# Altium schematic sheet Robot_demoborad.SchDoc
size A3; Author: WANG WEN; Engineer: WANG WEN; DocumentName: Biped Robot Demoboard; ProjectName: Biped Robot Demoboard
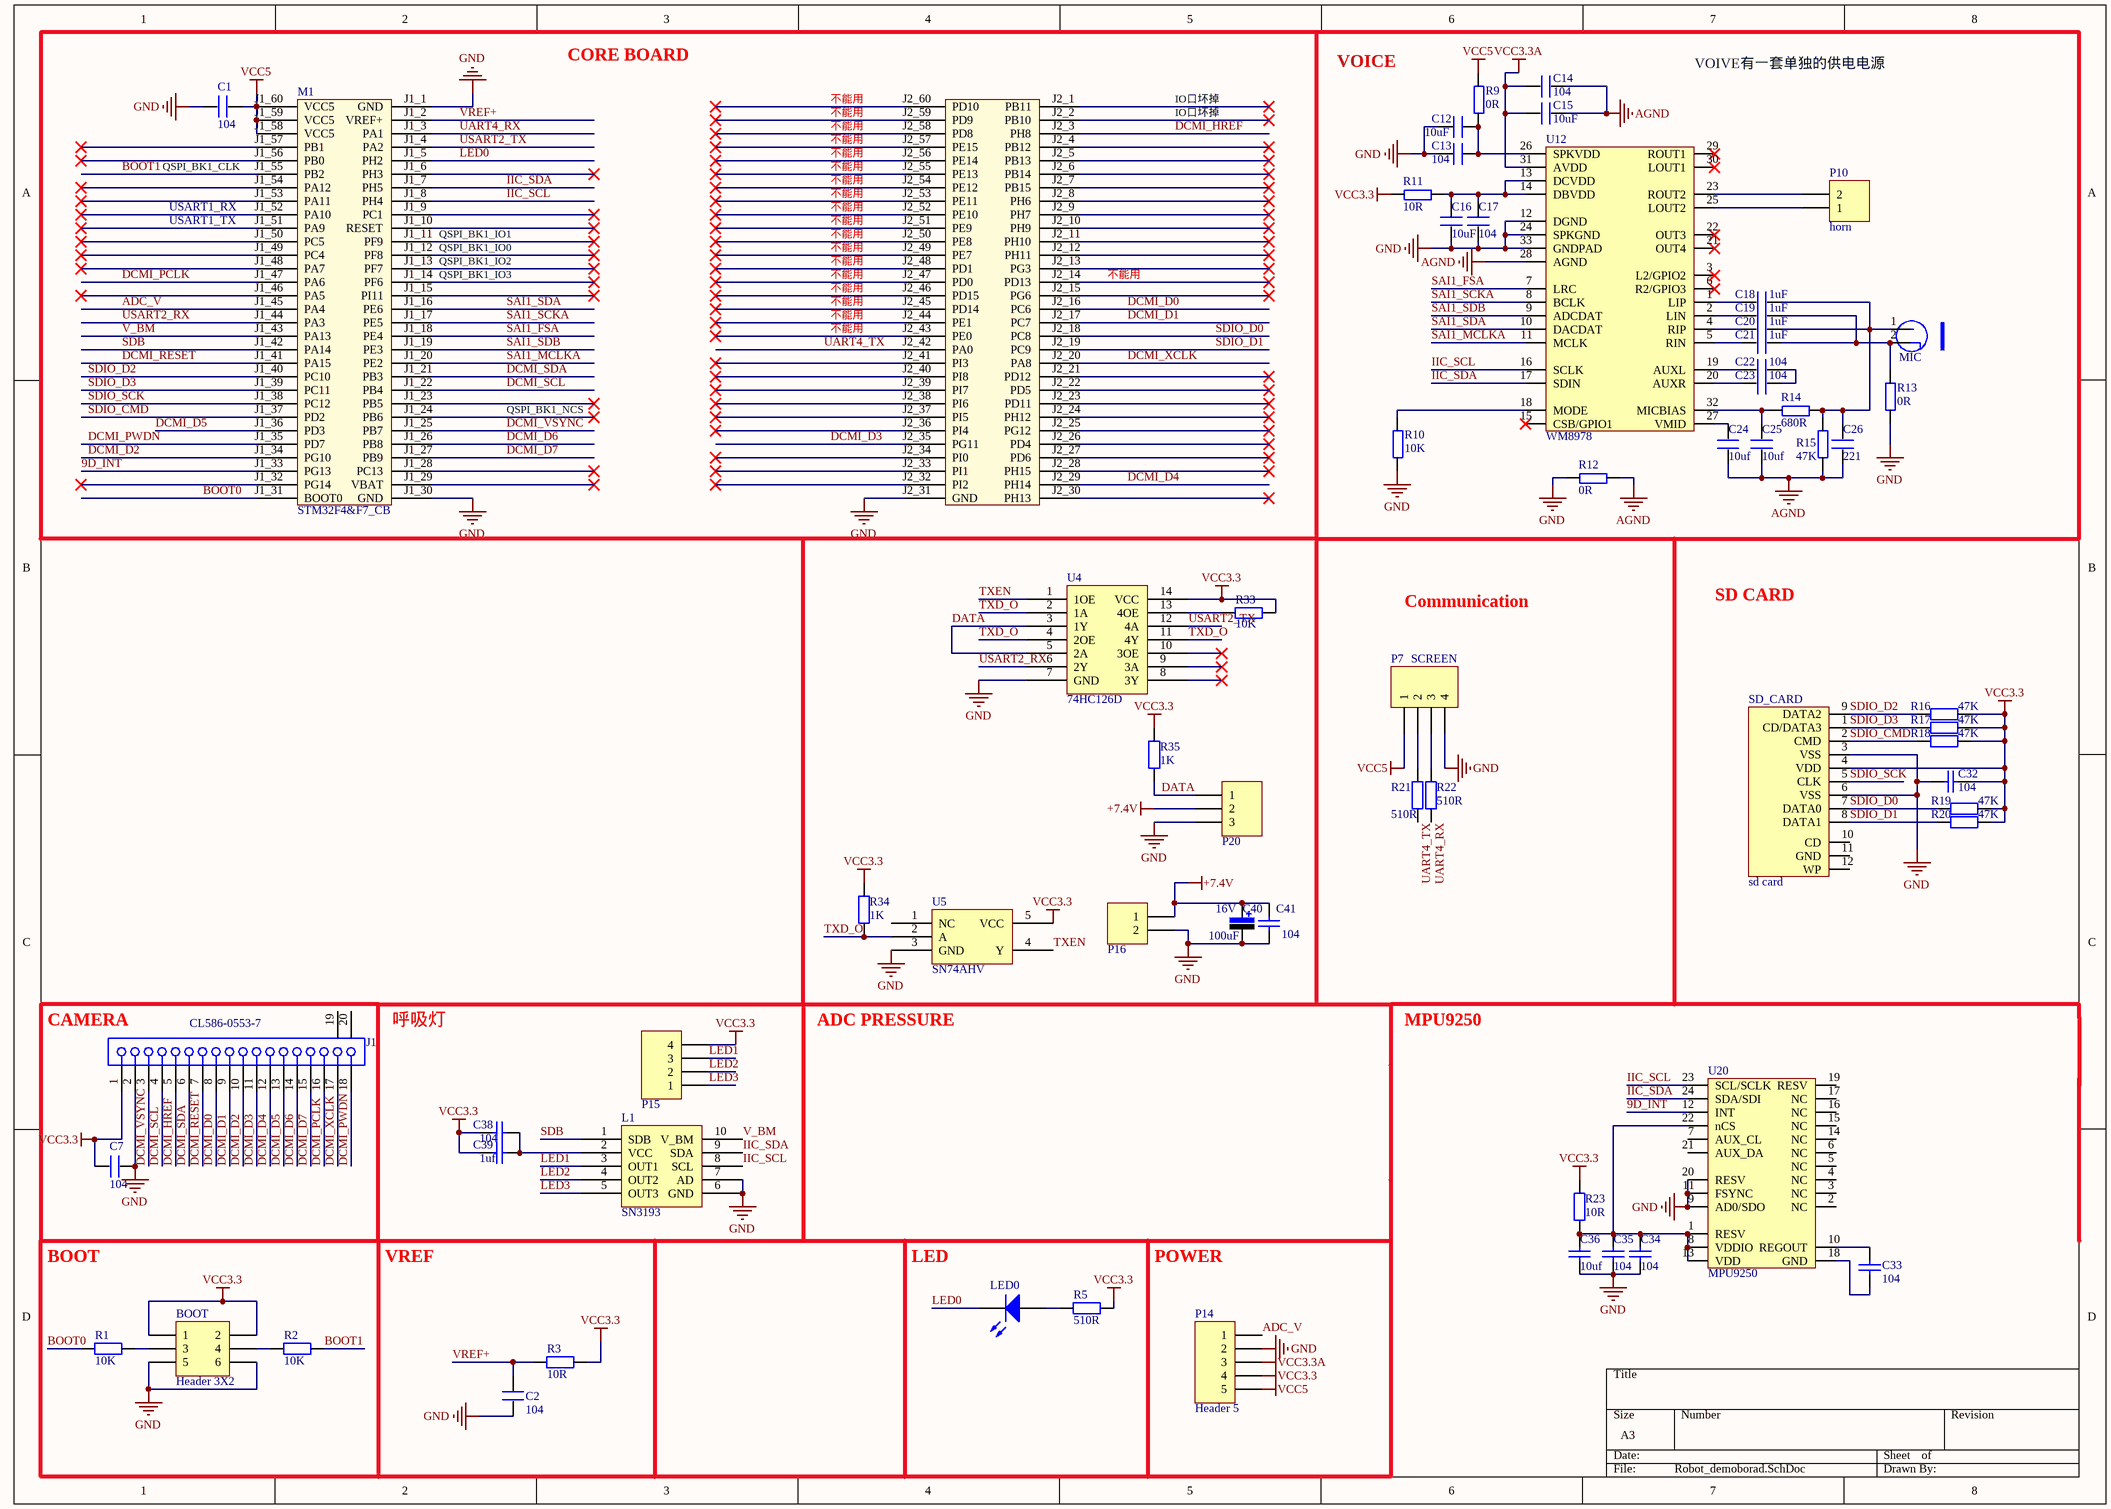
[diagram p0: Robot_demoborad.SchDoc]

## Parts
BOOT  Header 3X2  [HDR2X3]
C1  104  [0805]
C2  104  [0805]
C7  104  [0805]
C12  10uF  [0603P]
C13  104  [0603P]
C14  104  [0603P]
C15  10uF  [0603P]
C16  10uF  [0603P]
C17  104  [0603P]
C18  1uF  [0603P]
C19  1uF  [0603P]
C20  1uF  [0603P]
C21  1uF  [0603P]
C22  104  [0603P]
C23  104  [0603P]
C24  10uf  [0603P]
C25  10uf  [0603P]
C26  221  [0603P]
C32  value 104  [C-RAD-0805]  (hidden comment: Cap)
C33  value 104  [0603P]  (hidden comment: Cap)
C34  value 104  [0603P]  (hidden comment: Cap)
C35  value 104  [0603P]  (hidden comment: Cap)
C36  value 10uf  [0603P]  (hidden comment: Cap)
C38  value 104  [C-RAD-0805]  (hidden comment: Cap)
C39  value 1uf  [C-RAD-0805]  (hidden comment: Cap)
C40  value 100uF  Vol: 16V  [C-RB-8]  (hidden comment: Cap Pol)
C41  value 104  [C-RAD-0805]  (hidden comment: Cap)
J1  CL586-0553-7  [FH12A-18S-0.5SH]
L1  SN3193  [DFN_10]
LED0  LED1  [6-0805_M]  (value not drawn)
M1  STM32F4&F7_CB  [STM32F4&F7_CB]
MIC1  MIC  [HDR2X1_B1]
P7  SCREEN  [HDR1X4H]
P10  horn  [HDR1X2H]
P14  Header 5  [HDR1X5H]
P15  Header 4  [HDR4X1_B2]  (value not drawn)
P16  Header 2  [HDR2X1_B2]  (value not drawn)
P20  Header 3  [HDR3X1_B1]  (value not drawn)
R1  value 10K  [6-0805_N]  (hidden comment: Res2)
R2  value 10K  [6-0805_N]  (hidden comment: Res2)
R3  value 10R  [6-0805_N]  (hidden comment: Res2)
R5  value 510R  [6-0805_N]  (hidden comment: Res2)
R9  0R  [0603P]
R10  10K  [0603P]
R11  10R  [0603P]
R12  0R  [0603P]
R13  0R  [0603P]
R14  680R  [0603P]
R15  47K  [0603P]
R16  value 47K  [0805-1]  (hidden comment: Res1)
R17  value 47K  [0805-1]  (hidden comment: Res1)
R18  value 47K  [0805-1]  (hidden comment: Res1)
R19  value 47K  [0805-1]  (hidden comment: Res1)
R20  value 47K  [0805-1]  (hidden comment: Res1)
R21  value 510R  [0805-1]  (hidden comment: Res1)
R22  value 510R  [0805-1]  (hidden comment: Res1)
R23  value 10R  [0603P]  (hidden comment: Res1)
R33  value 10K  [0805-1]  (hidden comment: Res1)
R34  value 1K  [0805-1]  (hidden comment: Res1)
R35  value 1K  [0805-1]  (hidden comment: Res1)
SD_CARD  sd card  [SDCARD_L]
U4  74HC126D  [SOP-14N]
U5  SN74AHV  [SOT-23-5]
U12  WM8978  [qfn32]
U20  MPU9250  [QFN24-t]

## Nets
+7.4V: C40.1 C41.2 P16.1 P20.2
AGND: C14.2 C15.2 C24.1 C25.1 C26.1 R12.2 R15.1 U12.28(AGND)
GND: BOOT.5 BOOT.6 C1.1 C2.1 C7.2 C12.1 C13.1 C16.1 C17.1 C32.1 C34.1 C35.1 C36.1 C40.2 C41.1 J1.2 L1.6(GND) L1.7(AD) M1.J1_1(GND) M1.J1_30(GND) M1.J2_31(GND) P7.4 P14.2 P16.2 P20.3 R10.1 R12.1 R13.1 SD_CARD.3(VSS) SD_CARD.6(VSS) U4.7(GND) U5.3(GND) U12.12(DGND) U12.24(SPKGND) U12.33(GNDPAD) U20.9(AD0/SDO) U20.11(FSYNC) U20.20(RESV)
VCC3.3: BOOT.1 BOOT.2 C7.1 C32.2 C38.1 C39.1 J1.1 P14.4 P15.4 R3.2 R5.2 R11.1 R16.2 R17.2 R18.2 R19.2 R20.2 R23.2 R33.2 R34.2 R35.2 SD_CARD.4(VDD) U4.14(VCC) U5.5(VCC)
VCC3.3A: C14.1 C15.1 P14.3 U12.31(AVDD)
VCC5: C1.2 M1.J1_58(VCC5) M1.J1_59(VCC5) M1.J1_60(VCC5) P7.1 P14.5 R9.2
9D_INT: M1.J1_33(PG13) U20.12(INT)
ADC_V: M1.J1_45(PA4) P14.1
BOOT0: M1.J1_31(BOOT0) R1.1
BOOT1: M1.J1_55(PB2) R2.2
DATA: P20.1 R35.1 U4.3(1Y) U4.5(2A)
DCMI_D0: J1.8 M1.J2_16(PC6)
DCMI_D1: J1.9 M1.J2_17(PC7)
DCMI_D2: J1.10 M1.J1_34(PG10)
DCMI_D3: J1.11 M1.J2_35(PG11)
DCMI_D4: J1.12 M1.J2_29(PH14)
DCMI_D5: J1.13 M1.J1_36(PD3)
DCMI_D6: J1.14 M1.J1_26(PB8)
DCMI_D7: J1.15 M1.J1_27(PB9)
DCMI_HREF: J1.5 M1.J2_3(PH8)
DCMI_PCLK: J1.16 M1.J1_47(PA6)
DCMI_PWDN: J1.18 M1.J1_35(PD7)
DCMI_RESET: J1.7 M1.J1_41(PA15)
DCMI_SCL: J1.4 M1.J1_22(PB4)
DCMI_SDA: J1.6 M1.J1_21(PB3)
DCMI_VSYNC: J1.3 M1.J1_25(PB7)
DCMI_XCLK: J1.17 M1.J2_20(PA8)
IIC_SCL: L1.8(SCL) M1.J1_8(PH4) U12.16(SCLK) U20.23(SCL/SCLK)
IIC_SDA: L1.9(SDA) M1.J1_7(PH5) U12.17(SDIN) U20.24(SDA/SDI)
LED0: LED0.2(K) M1.J1_5(PH2)
LED1: L1.3(OUT1) P15.3
LED2: L1.4(OUT2) P15.2
LED3: L1.5(OUT3) P15.1
SAI1_FSA: M1.J1_18(PE4) U12.7(LRC)
SAI1_MCLKA: M1.J1_20(PE2) U12.11(MCLK)
SAI1_SCKA: M1.J1_17(PE5) U12.8(BCLK)
SAI1_SDA: M1.J1_16(PE6) U12.10(DACDAT)
SAI1_SDB: M1.J1_19(PE3) U12.9(ADCDAT)
SDB: L1.1(SDB) M1.J1_42(PA14)
SDIO_CMD: M1.J1_37(PD2) R18.1 SD_CARD.2(CMD)
SDIO_D0: M1.J2_18(PC8) R19.1 SD_CARD.7(DATA0)
SDIO_D1: M1.J2_19(PC9) R20.1 SD_CARD.8(DATA1)
SDIO_D2: M1.J1_40(PC10) R16.1 SD_CARD.9(DATA2)
SDIO_D3: M1.J1_39(PC11) R17.1 SD_CARD.1(CD/DATA3)
SDIO_SCK: M1.J1_38(PC12) SD_CARD.5(CLK)
TXD_O: R34.1 U4.2(1A) U4.4(2OE) U4.11(4Y) U5.2(A)
TXEN: U4.1(1OE) U5.4(Y)
UART4_RX: M1.J1_3(PA1) R22.1
UART4_TX: M1.J2_42(PA0) R21.1
USART2_RX: M1.J1_44(PA3) U4.6(2Y)
USART2_TX: M1.J1_4(PA2) U4.12(4A)
V_BM: L1.10(V_BM) M1.J1_43(PA13)
VREF+: C2.2 M1.J1_2(VREF+) R3.1
NetBOOT_3: BOOT.3 R1.2
NetBOOT_4: BOOT.4 R2.1
NetC12_2: C12.2 C13.2 R9.1 U12.26(SPKVDD)
NetC16_2: C16.2 C17.2 R11.2 U12.13(DCVDD) U12.14(DBVDD)
NetC18_1: C18.1 U12.1(LIP)
NetC18_2: C18.2 C20.2 C26.2 MIC1.1(VCC) R14.2 R15.2
NetC19_1: C19.1 U12.2(LIN)
NetC19_2: C19.2 C21.2 MIC1.2(GND) R13.2
NetC20_1: C20.1 U12.4(RIP)
NetC21_1: C21.1 U12.5(RIN)
NetC22_1: C22.1 U12.19(AUXL)
NetC22_2: C22.2 C23.2
NetC23_1: C23.1 U12.20(AUXR)
NetC24_2: C24.2 U12.27(VMID)
NetC25_2: C25.2 R14.1 U12.32(MICBIAS)
NetC33_1: C33.1 U20.18(GND)
NetC33_2: C33.2 U20.10(REGOUT)
NetC34_2: C34.2 C35.2 C36.2 R23.1 U20.1(RESV) U20.8(VDDIO) U20.13(VDD) U20.22(nCS)
NetC38_2: C38.2 C39.2 L1.2(VCC)
NetLED0_1: LED0.1(A) R5.1
NetP7_2: P7.2 R21.2
NetP7_3: P7.3 R22.2
NetP10_1: P10.1 U12.25(LOUT2)
NetP10_2: P10.2 U12.23(ROUT2)
NetR10_2: R10.2 U12.18(MODE)
NetR33_1: R33.1 U4.13(4OE)

Not connected (* = marked no-connect by the designer): J1 19(MH1) 20(MH2); M1 J1_6(PH3)* J1_9(PC1)* J1_10(RESET)* J1_11(PF9)* J1_12(PF8)* J1_13(PF7)* J1_14(PF6)* J1_15(PI11)* J1_23(PB5)* J1_24(PB6)* J1_28(PC13)* J1_29(VBAT)* J1_32(PG14)* J1_46(PA5)* J1_48(PA7)* J1_49(PC4)* J1_50(PC5)* J1_51(PA9)* J1_52(PA10)* J1_53(PA11)* J1_54(PA12)* J1_56(PB0)* J1_57(PB1)* J2_1(PB11)* J2_2(PB10)* J2_4(PB12)* J2_5(PB13)* J2_6(PB14)* J2_7(PB15)* J2_8(PH6)* J2_9(PH7)* J2_10(PH9)* J2_11(PH10)* J2_12(PH11)* J2_13(PG3)* J2_14(PD13)* J2_15(PG6)* J2_21(PD12)* J2_22(PD5)* J2_23(PD11)* J2_24(PH12)* J2_25(PG12)* J2_26(PD4)* J2_27(PD6)* J2_28(PH15)* J2_30(PH13)* J2_32(PI2)* J2_33(PI1)* J2_34(PI0)* J2_36(PI4)* J2_37(PI5)* J2_38(PI6)* J2_39(PI7)* J2_40(PI8)* J2_41(PI3)* J2_43(PE0)* J2_44(PE1)* J2_45(PD14)* J2_46(PD15)* J2_47(PD0)* J2_48(PD1)* J2_49(PE7)* J2_50(PE8)* J2_51(PE9)* J2_52(PE10)* J2_53(PE11)* J2_54(PE12)* J2_55(PE13)* J2_56(PE14)* J2_57(PE15)* J2_58(PD8)* J2_59(PD9)* J2_60(PD10)*; SD_CARD 10(CD) 11(GND) 12(WP); U4 8(3Y)* 9(3A)* 10(3OE)*; U5 1(NC); U12 3(L2/GPIO2)* 6(R2/GPIO3)* 15(CSB/GPIO1)* 21(OUT4)* 22(OUT3)* 29(ROUT1)* 30(LOUT1)*; U20 2(NC) 3(NC) 4(NC) 5(NC) 6(NC) 7(AUX_CL) 14(NC) 15(NC) 16(NC) 17(NC) 19(RESV) 21(AUX_DA)

## Notes on the sheet
- (near M1) CORE BOARD
- (near M1) 不能用
- IO口坏掉
- VOICE
- VOIVE有一套单独的供电电源
- QSPI_BK1_CLK
- USART1_TX
- USART1_RX
- (near M1) QSPI_BK1_IO1
- (near M1) QSPI_BK1_IO0
- (near M1) QSPI_BK1_IO2
- (near M1) QSPI_BK1_IO3
- 不能用
- (near M1) QSPI_BK1_NCS
- Communication
- SD CARD
- (near J1) CAMERA
- (near J1) 呼吸灯
- ADC PRESSURE
- MPU9250
- BOOT
- VREF
- LED
- POWER

## Library data of the parts
BOOT = Header 3X2: Header, 3-Pin, Dual row; LatestRevisionDate: 17-Jul-2002; LatestRevisionNote: Re-released for DXP Platform.; Publisher: Altium Limited
C1 C2 C7 C12-C26 = C
C32-C36 C38 C39 C41 = Cap: 无极性电容; Published: 8-Jun-2000; LatestRevisionDate: 17-Jul-2002; LatestRevisionNote: Re-released for DXP Platform.; PackageReference: RAD-0.3; Publisher: Altium Limited
C40 = Cap Pol: 极性电解电容; Published: 8-Jun-2000; LatestRevisionDate: 17-Jul-2002; LatestRevisionNote: Re-released for DXP Platform.; PackageReference: RB7.6-15; Publisher: Altium Limited
J1 = CL586-0553-7: FH12 Series, "Flip-Lock" SMT/ZIF Connector - 0.5mm Spaced Top Contact; Positions: 18; ContactMaterial: Phosphor Bronze; Current: 0.4A; PCB_Layout: Complies with manufacturer's recommendation.; Note: Pad dimensions follow nominal values, Suitable for Wave Soldering, Adjust for Re-flow.; Published: 17-Jul-2002; DatasheetDocument: 13-Nov-2000; PackageDocument: 13-Nov-2000; PackageReference: FH12A-18S-0.5SH; Publisher: Altium Limited; ComponentLink1Description: Manufacturer Link; ComponentLink1URL: http://www.hiroseusa.com/; ComponentLink2Description: Datasheet; ComponentLink2URL: http://www.hirose.co.jp/cataloge_hp/e58605370.pdf
L1 U4 U5 = Component_1
LED0 = LED2: Typical RED, GREEN, YELLOW, AMBER GaAs LED; Published: 8-Jun-2000; LatestRevisionDate: 17-Jul-2002; LatestRevisionNote: Re-released for DXP Platform.; PackageDocument: Feb-2002; PackageReference: 3.2X1.6X1.1; Publisher: Altium Limited
M1 = STM32F4&F7_CB: F429/746 Core Board
P7 = Header 4H: Header, 4-Pin, Right Angle; LatestRevisionDate: 17-Jul-2002; LatestRevisionNote: Re-released for DXP Platform.; Publisher: Altium Limited
P10 = Header 2H: Header, 2-Pin, Right Angle; LatestRevisionDate: 17-Jul-2002; LatestRevisionNote: Re-released for DXP Platform.; Publisher: Altium Limited
P14 = Header 5: Header, 5-Pin; LatestRevisionDate: 17-Jul-2002; LatestRevisionNote: Re-released for DXP Platform.; Publisher: Altium Limited
P15 = Header 4: 接插件; LatestRevisionDate: 17-Jul-2002; LatestRevisionNote: Re-released for DXP Platform.; Publisher: Altium Limited
P16 = Header 2: 接插件; LatestRevisionDate: 17-Jul-2002; LatestRevisionNote: Re-released for DXP Platform.; Publisher: Altium Limited
P20 = Header 3: 接插件; LatestRevisionDate: 17-Jul-2002; LatestRevisionNote: Re-released for DXP Platform.; Publisher: Altium Limited
R1-R3 R5 = Res2: Resistor; Published: 8-Jun-2000; LatestRevisionDate: 17-Jul-2002; LatestRevisionNote: Re-released for DXP Platform.; PackageReference: AXIAL-0.4; Publisher: Altium Limited; PackageDescription: Axial Device, Thru-Hole; 2 Leads; 0.4 in Pin Spacing
R9-R15 = R
R16-R23 R33-R35 = Res1: 贴片电阻; Published: 8-Jun-2000; LatestRevisionDate: 17-Jul-2002; LatestRevisionNote: Re-released for DXP Platform.; PackageReference: AXIAL-0.4; Publisher: Altium Limited
U12 = WM8978: 24bit ADC&DAC
U20 = MPU9250: 9轴运动处理传感器